# Altium schematic sheet IC102.schdoc
size 67 x 65 mm
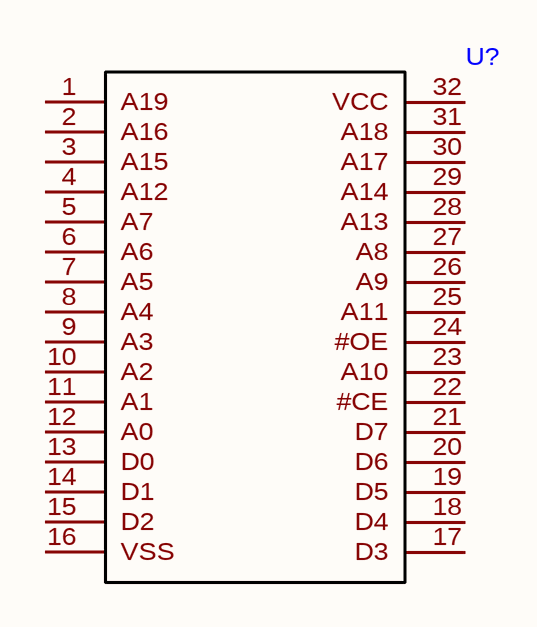
[diagram p0: IC102.schdoc]

## Parts
U?  (no value)  [SOP-32_L20.9-W11.4-P1.27-LS14.12-BL]

## Nets

Not connected (* = marked no-connect by the designer): U? 1(A19) 2(A16) 3(A15) 4(A12) 5(A7) 6(A6) 7(A5) 8(A4) 9(A3) 10(A2) 11(A1) 12(A0) 13(D0) 14(D1) 15(D2) 16(VSS) 17(D3) 18(D4) 19(D5) 20(D6) 21(D7) 22(#CE) 23(A10) 24(#OE) 25(A11) 26(A9) 27(A8) 28(A13) 29(A14) 30(A17) 31(A18) 32(VCC)

## Library data of the parts
U? = IC102